# EAGLE design ambient_rpi_shield (EAGLE 7.7.0)
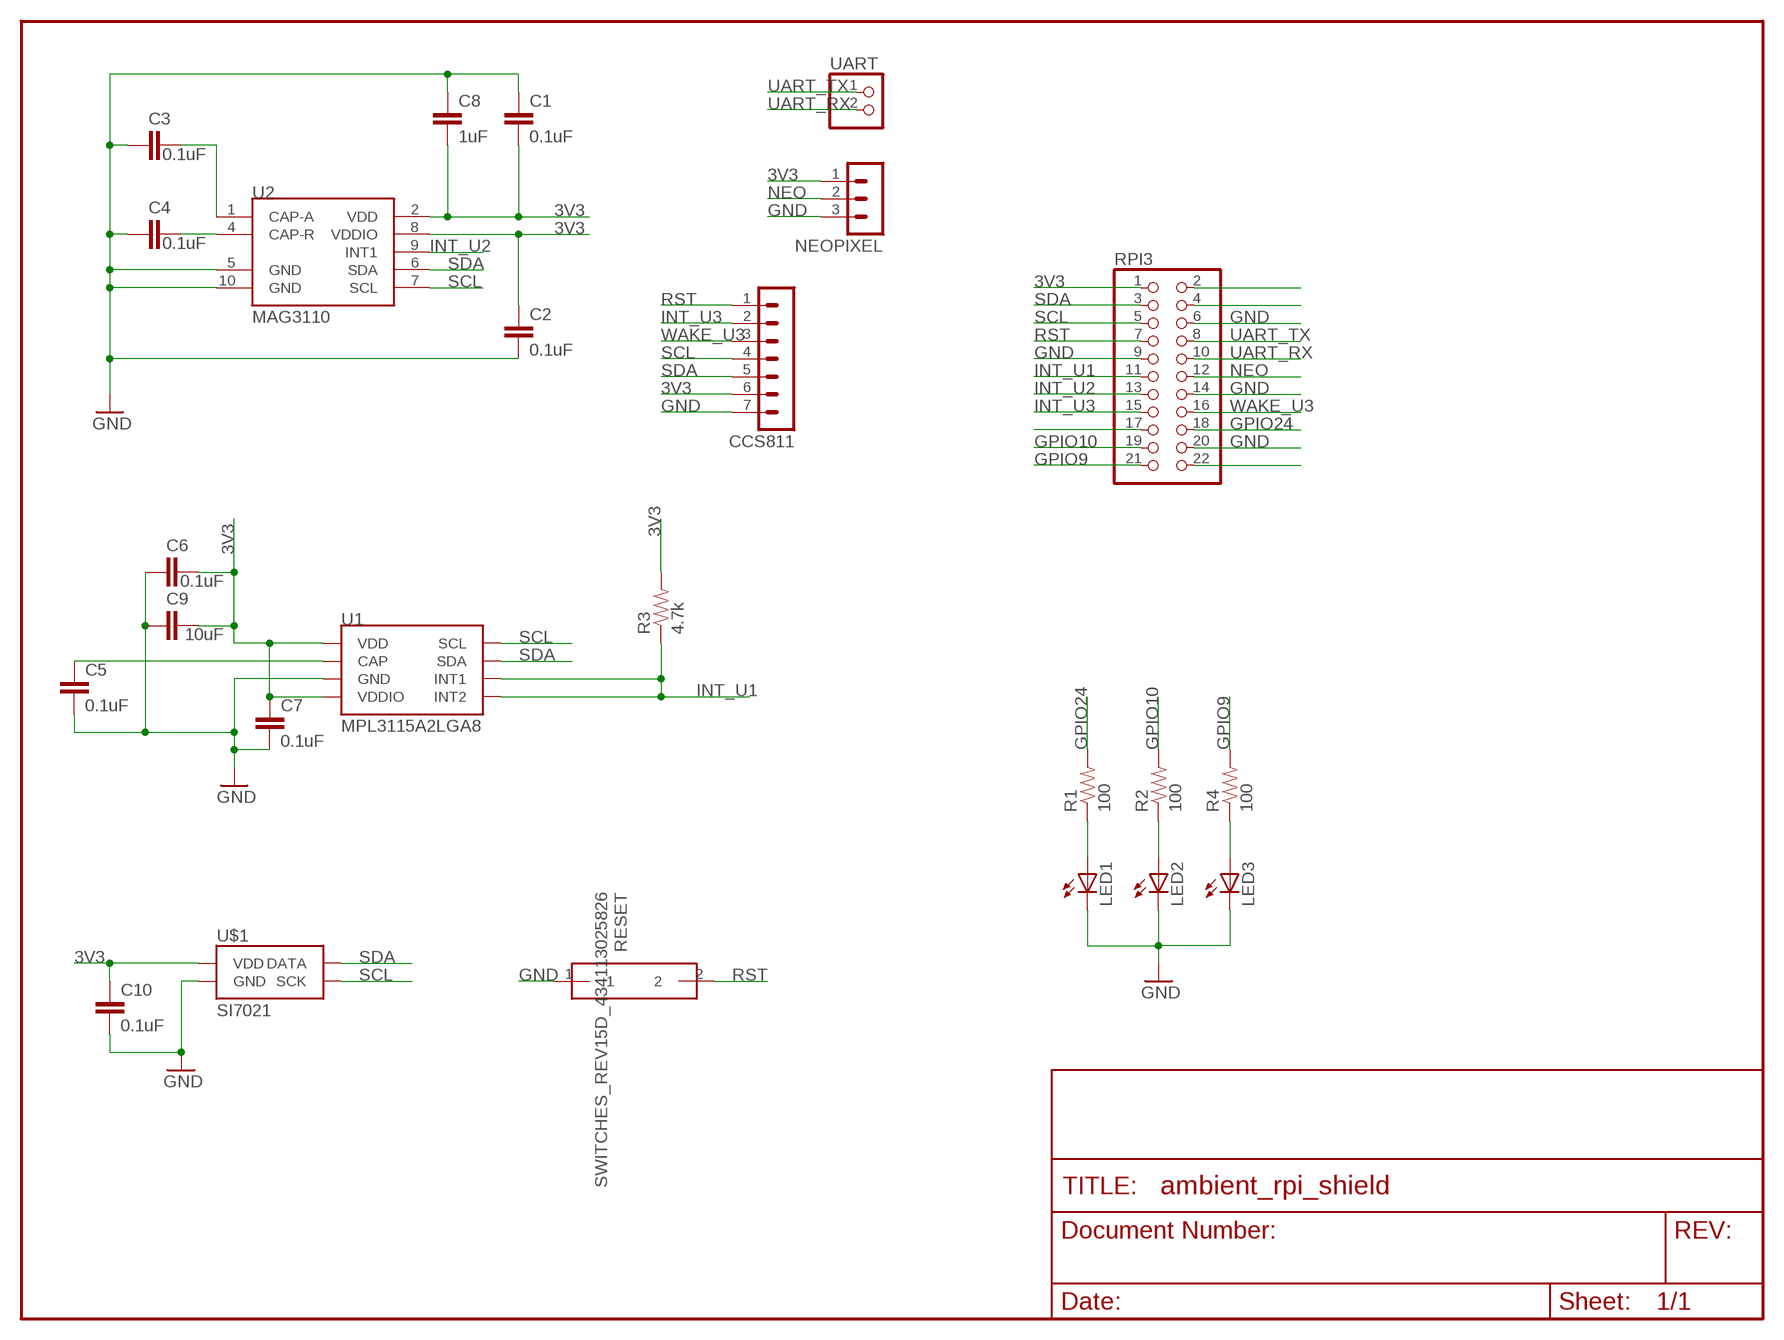
[diagram p0: schematic, sheet 1]

## Parts
C1  0.1uF  CAP0603-CAP  [0603-CAP]
C2  0.1uF  CAP0603-CAP  [0603-CAP]
C3  0.1uF  CAP0603-CAP  [0603-CAP]
C4  0.1uF  CAP0603-CAP  [0603-CAP]
C5  0.1uF  CAP0603-CAP  [0603-CAP]
C6  0.1uF  CAP0603-CAP  [0603-CAP]
C7  0.1uF  CAP0603-CAP  [0603-CAP]
C8  1uF  CAP0603-CAP  [0603-CAP]
C9  10uF  CAP0603-CAP  [0603-CAP]
C10  0.1uF  CAP0603-CAP  [0603-CAP]
CCS811  MA07-1  [MA07-1]
LED1  LED_LEDCHIP-LED0805  [LED_CHIP-LED0805]
LED2  LED_LEDCHIP-LED0805  [LED_CHIP-LED0805]
LED3  LED_LEDCHIP-LED0603  [LED_CHIP-LED0603]
NEOPIXEL  MA03-1  [MA03-1]
R1  100  SPARKFUN_RESISTOR0603-RES  [SPARKFUN_0603-RES]
R2  100  SPARKFUN_RESISTOR0603-RES  [SPARKFUN_0603-RES]
R3  4.7k  RESISTOR0603-RES  [0603-RES]
R4  100  SPARKFUN_RESISTOR0603-RES  [SPARKFUN_0603-RES]
RESET  SWITCHES_REV15D_434113025826  [SWITCHES_REV15D_434113025826]
RPI3  PINHD-2X11  [2X11]
U1  MPL3115A2LGA8  [LGA8]
U2  MAG3110  [DFN-10]
U$1  SI7021  [SI7021]
UART  PINHD-1X2  [1X02]

## Nets
3V3: C1.2 C2.1 C6.2 C7.1 C8.2 C9.2 C10.1 CCS811.6 NEOPIXEL.1 R3.2 RPI3.1 U1.1(VDD) U1.4(VDDIO) U2.2(VDD) U2.8(VDDIO) U$1.VDD
GND: C1.1 C2.2 C3.1 C4.1 C5.2 C6.1 C7.2 C8.1 C9.1 C10.2 CCS811.7 LED1.C LED2.C LED3.C NEOPIXEL.3 RESET.1 RPI3.6 RPI3.9 RPI3.14 RPI3.20 U1.3(GND) U2.5(GND) U2.10(GND) U$1.GND
GPIO9: R4.2 RPI3.21
GPIO10: R2.2 RPI3.19
GPIO24: R1.2 RPI3.18
INT_U1: R3.1 RPI3.11 U1.5(INT2) U1.6(INT1)
INT_U2: RPI3.13 U2.9(INT1)
INT_U3: CCS811.2 RPI3.15
N$1: C3.2 U2.1(CAP-A)
N$2: C4.2 U2.4(CAP-R)
N$3: C5.1 U1.2(CAP)
N$4: LED1.A R1.1
N$5: LED2.A R2.1
N$6: LED3.A R4.1
N$15: RPI3.17
N$18: RPI3.2
N$19: RPI3.4
N$28: RPI3.22
NEO: NEOPIXEL.2 RPI3.12
RST: CCS811.1 RESET.2 RPI3.7
SCL: CCS811.4 RPI3.5 U1.8(SCL) U2.7(SCL) U$1.SCK
SDA: CCS811.5 RPI3.3 U1.7(SDA) U2.6(SDA) U$1.DATA
UART_RX: RPI3.10 UART.2
UART_TX: RPI3.8 UART.1
WAKE_U3: CCS811.3 RPI3.16

## Library data of the parts
C1-C10 = SparkFun-Capacitors:CAP: Capacitor Standard 0603 ceramic capacitor, and 0.1" leaded capacitor.
CCS811 = con-lstb:MA07-1: PIN HEADER; OC_FARNELL: unknown; OC_NEWARK: unknown
LED1-LED3 = OCTA-EZR_v1:LED_LED: LED OSRAM: - CHIPLED LG R971, LG N971, LY N971, LG Q971, LY Q971, LO R971, LY R971 LH N974, LH R974 LS Q976, LO Q976, LY Q976 LO Q996 - Hyper CHIPLED LW Q18S LB Q993, LB Q99A, LB R99A - SideLED LS A670, LO A670, LY A670, LG A670, LP A670 LB A673, LV A673, LT A673, LW A673 LH A674 LY A675 LS A676, LA A676, LO A676, LY A676, LW A676 LS A679, LY A679, LG A679 - Hyper Micro SIDELED® LS Y876, LA Y876, LO Y876, LY Y876 LT Y87S - SmartLED LW L88C, LW L88S LB L89C, LB L89S, LG L890 LS L89K, LO L89K, LY L89K LS L896, LA L896, LO L896, LY L896 - TOPLED LS T670, LO T670, LY T670, LG T670, LP T670 LSG T670, LSP T670, LSY T670, LOP T670, LYG T670 LG T671, LOG T671, LSG T671 LB T673, LV T673, LT T673, LW T673 LH T674 LS T676, LA T676, LO T676, LY T676, LB T676, LH T676, LSB T676, LW T676 LB T67C, LV T67C, LT T67C, LS T67K, LO T67K, LY T67K, LW E67C LS E67B, LA E67B, LO E67B, LY E67B, LB E67C, LV E67C, LT E67C LW T67C LS T679, LY T679, LG T679 LS T770, LO T770, LY T770, LG T770, LP T770 LB T773, LV T773, LT T773, LW T773 LH T774 LS E675, LA E675, LY E675, LS T675 LS T776, LA T776, LO T776, LY T776, LB T776 LHGB T686 LT T68C, LB T68C - Hyper Mini TOPLED® LB M676 - Mini TOPLED Santana® LG M470 LS M47K, LO M47K, LY M47K Source: http://www.osram.convergy.de LUXEON: - LUMILED® LXK2-PW12-R00, LXK2-PW12-S00, LXK2-PW14-U00, LXK2-PW14-V00 LXK2-PM12-R00, LXK2-PM12-S00, LXK2-PM14-U00 LXK2-PE12-Q00, LXK2-PE12-R00, LXK2-PE12-S00, LXK2-PE14-T00, LXK2-PE14-U00 LXK2-PB12-K00, LXK2-PB12-L00, LXK2-PB12-M00, LXK2-PB14-N00, LXK2-PB14-P00, LXK2-PB14-Q00 LXK2-PR12-L00, LXK2-PR12-M00, LXK2-PR14-Q00, LXK2-PR14-R00 LXK2-PD12-Q00, LXK2-PD12-R00, LXK2-PD12-S00 LXK2-PH12-R00, LXK2-PH12-S00 LXK2-PL12-P00, LXK2-PL12-Q00, LXK2-PL12-R00 Source: www.luxeon.com KINGBRIGHT: KA-3528ASYC Source: www.kingbright.com
NEOPIXEL = con-lstb:MA03-1: PIN HEADER; OC_FARNELL: unknown; OC_NEWARK: unknown
R1 R2 R4 = OCTA-EZR_v1:SPARKFUN_RESISTOR: Resistor Basic schematic elements and footprints for 0603, 1206, and PTH resistors.
R3 = SparkFun-Resistors:RESISTOR: Resistor Basic schematic elements and footprints for 0603, 1206, and PTH resistors.
RESET = OCTA-EZR_v1:SWITCHES_REV15D_434113025826: WS-TRS-6x3.8 mm J-Bend SMD Tact Switch, 2 pins
RPI3 = pinhead:PINHD-2X11: PIN HEADER
U1 = SparkFun-Sensors:MPL3115A2: Altimeter/Pressure Sensor, I2C, 1.95V-3.6V supply, 50 to 110kPa; PROD_ID: IC-10869
U2 = SparkFun-Sensors:MAG3110: 3-axis digital (I2C) magnetometer
U$1 = SparkFun-Sensors:SI7021: The Si7021 is an I2C Humidity and Temperature Sensor; PROD_ID: IC-13093
UART = pinhead:PINHD-1X2: PIN HEADER

## Board
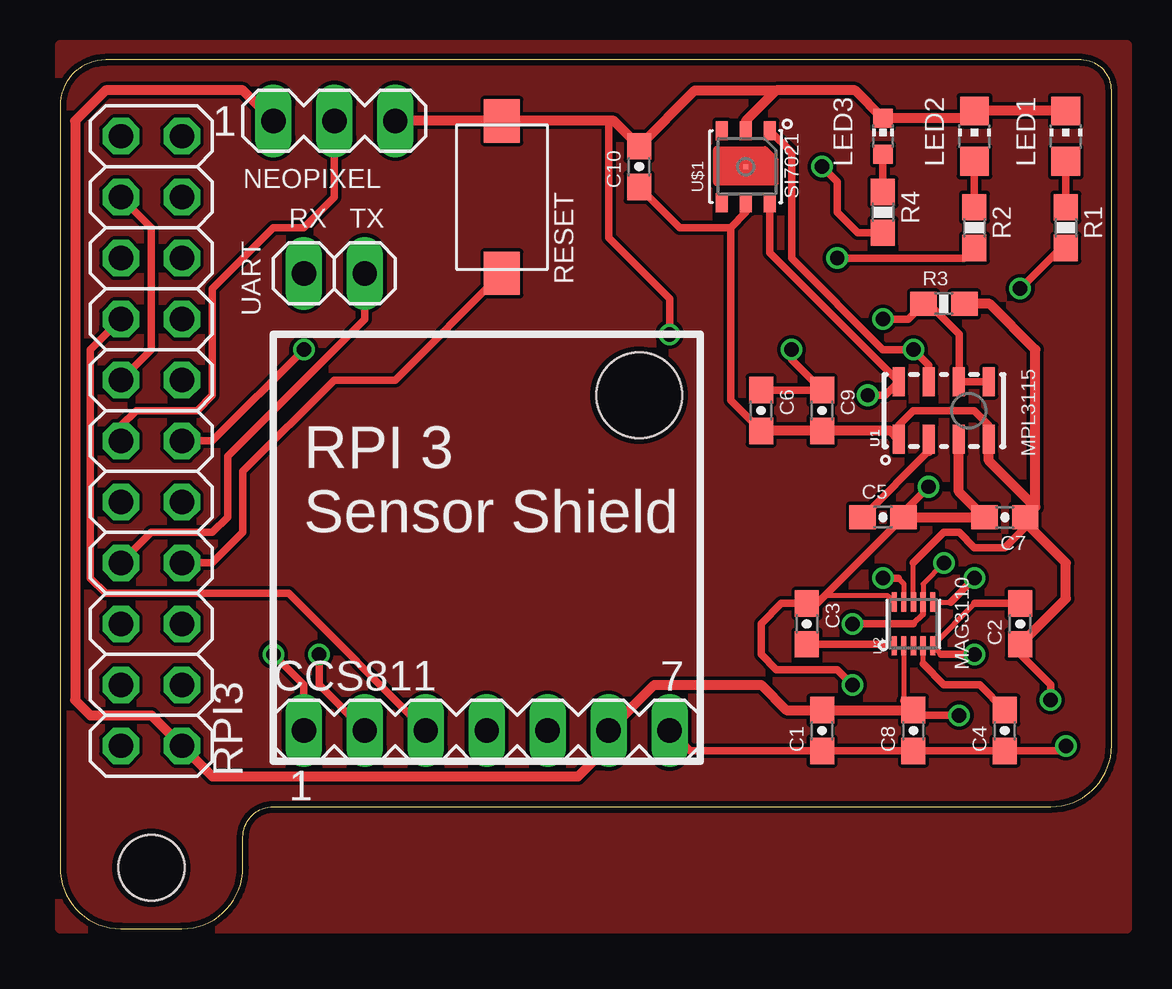
[diagram p1: board, top side]
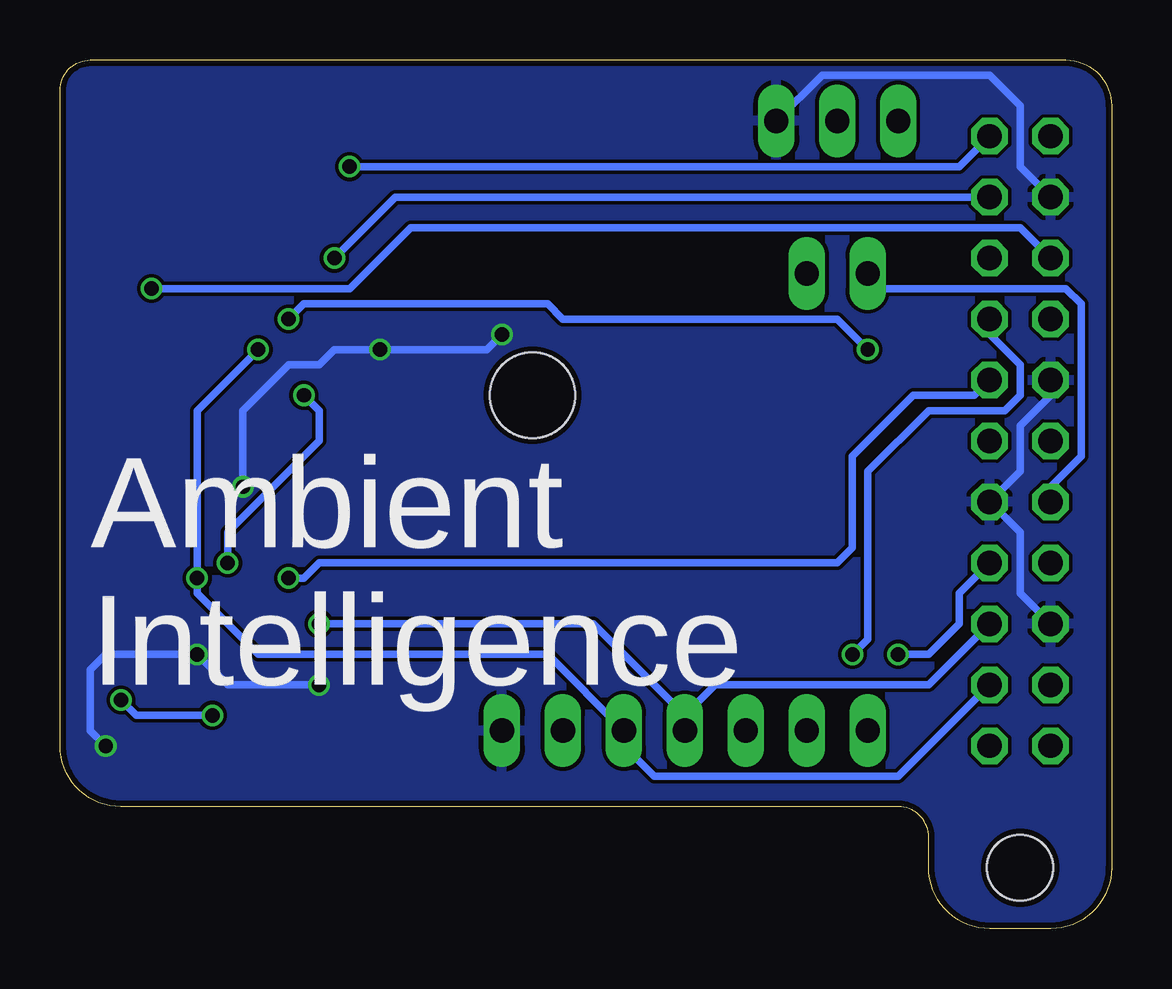
[diagram p2: board, bottom side, seen from below]

Size 43.81 x 36.2 mm. Coordinates in mm from the lower left corner, seen from the top.
Outline: 0,2.54 arc90 2.54,0 5.08,0 arc90 7.62,2.54 7.62,3.81 arc-90 8.89,5.08 41.27,5.08 arc90 43.81,7.62 43.81,34.92 arc90 42.55,36.2 1.91,36.2 arc90 0,34.29 0,2.54
Copper layers (1*16): Top 0.018mm / dielectric 1.55mm / Bottom 0.018mm
Design rules "eC_2Layer_PClass6_BaseCopperO18_eCDefault": minimum track width 0.15mm, minimum drill 0.35mm, track to track 0.15mm, track to pad 0.15mm, pad to pad 0.15mm, via to via 0.15mm, smd to smd 0mil, copper to edge 0.25mm, drill to drill 0.35mm, minimum pad ring 0.175mm, minimum via ring 0.125mm, stop-mask expansion 0mil, vias tented up to drill 0.45mm, thermal gap 0.2mm
Holes 3.56 mm at 24.13,22.23
Holes 2.75 mm at 3.81,2.54

### Footprints (pad centres in the part's own frame; a part is rotated, then mirrored left to right if it is on the bottom)
0603-CAP = smd 1.1 x 1: 1 -0.85,0; 2 0.85,0
MA07-1 = drill 1.016 long: 1 -7.62,0; 2 -5.08,0; 3 -2.54,0; 4 0,0; 5 2.54,0; 6 5.08,0; 7 7.62,0
LED_CHIP-LED0805 = smd 1.2 x 1.2: A 0,-1.05; C 0,1.05
LED_CHIP-LED0603 = smd 0.8 x 0.8: A 0,-0.75; C 0,0.75
MA03-1 = drill 1.016 long: 1 -2.54,0; 2 0,0; 3 2.54,0
SPARKFUN_0603-RES = smd 1.1 x 1: 1 -0.85,0; 2 0.85,0
0603-RES = smd 1.1 x 1: 1 -0.85,0; 2 0.85,0
SWITCHES_REV15D_434113025826 = smd 1.8 x 1.5: 1 -3.175,0; 2 3.175,0
2X11 = drill 1.016 octagon: 1 -12.7,-1.27; 2 -12.7,1.27; 3 -10.16,-1.27; 4 -10.16,1.27; 5 -7.62,-1.27; 6 -7.62,1.27; 7 -5.08,-1.27; 8 -5.08,1.27; 9 -2.54,-1.27; 10 -2.54,1.27; 11 0,-1.27; 12 0,1.27; 13 2.54,-1.27; 14 2.54,1.27; 15 5.08,-1.27; 16 5.08,1.27; 17 7.62,-1.27; 18 7.62,1.27; 19 10.16,-1.27; 20 10.16,1.27; 21 12.7,-1.27; 22 12.7,1.27
LGA8 = smd 1.2 x 0.5: 1 -1.2,1.875; 2 -1.2,0.625; 3 -1.2,-0.625; 4 -1.2,-1.875; 5 1.2,-1.875; 6 1.2,-0.625; 7 1.2,0.625; 8 1.2,1.875
DFN-10 = smd 0.8 x 0.22: 1 -0.91,0.8; 2 -0.91,0.4; 3 -0.91,0; 4 -0.91,-0.4; 5 -0.91,-0.8; 6 0.91,-0.8; 7 0.91,-0.4; 8 0.91,0; 9 0.91,0.4; 10 0.91,0.8
SI7021 = smd 0.2 x 0.2: 7 0,0 | smd 0.8 x 0.5: DATA 1.5,-1; GND 1.5,0; NC@3 1.5,1; NC@4 -1.5,1; SCK -1.5,-1; VDD -1.5,0
1X02 = drill 1.016 long: 1 -1.27,0; 2 1.27,0

### Placement (x,y rotation side)
C1  31.75,8.25 90 top
C2  40.01,12.7 90 top
C3  31.11,12.7 270 top
C4  39.37,8.25 90 top
C5  34.29,17.14 0 top
C6  29.21,21.59 270 top
C7  39.37,17.14 180 top
C8  35.56,8.25 90 top
C9  31.75,21.59 270 top
C10  24.13,31.75 90 top
CCS811  17.78,8.25 0 top
LED1  41.91,33.02 0 top
LED2  38.1,33.02 0 top
LED3  34.29,33.02 0 top
NEOPIXEL  11.43,33.66 0 top
R1  41.91,29.21 270 top
R2  38.1,29.21 270 top
R3  36.83,26.03 0 top
R4  34.29,29.84 270 top
RESET  18.41,30.48 270 top
RPI3  3.81,20.32 90 top
U1  36.83,21.59 90 top
U2  35.56,12.7 90 top
U$1  28.57,31.75 90 top
UART  11.43,27.3 180 top

### Tracks (layer width: path | path; a pad name or v marks a point on that pad's centre or on a via)
3V3  (via drill 0.6)
  Top 0.203: U2.8 35.56,15.24 | U2.2 35.16,9.5
  Top 0.305: 35.16,9.5 C8.2 35.77,8.89 v37.47,8.89 | U1.4 38.7,20.98 38.1,21.59 35.56,21.59 34.95,20.98 U1.1 | C10.1 25.82,29.21 27.94,29.21 | 27.94,29.21 28.57,29.84 U$1.VDD | C7.1 40.22,16.73 39.37,15.88 38.1,15.88 37.47,16.51 36.83,16.51 35.56,15.24 | C6.2 27.94,22.01 27.94,29.21 | v41.27,9.53 41.27,10.16 40.01,11.43 C2.1
  Top 0.406: C8.2 C1.2 30.27,9.11 29.21,10.16 24.77,10.16 CCS811.6 22.86,7.62 21.59,6.35 6.35,6.35 RPI3.1 3.81,8.89 1.27,8.89 0.64,9.53 0.64,33.66 1.91,34.92 7.62,34.92 NEOPIXEL.1 | C2.1 41.91,13.76 41.91,15.24 40.22,16.93 C7.1 40.64,17.56 | 40.64,17.56 40.64,24.13 38.73,26.03 R3.2 | 40.64,17.56 38.7,19.5 U1.4 | U1.1 34.6,20.74 C9.2 C6.2
  Bottom 0.305: v37.47,8.89 40.64,8.89 v41.27,9.53
GND  (via drill 0.6)
  Top 0.203: U2.10 34.51,13.86 31.86,13.86 | 38.12,13.55 U2.5 36.72,11.43
  Top 0.305: C6.1 C9.1 30.48,23.71 v30.48,24.13 | 38.12,13.55 C2.2 | CCS811.7 26.25,7.41 C1.1 C8.1 C4.1 41.7,7.41 v41.91,7.62 | 22.86,33.66 22.86,28.79 25.4,26.25 v25.4,24.77 | RPI3.14 3.81,24.13 3.81,29.21 RPI3.20 | 36.72,11.43 v38.1,11.43 | v36.2,18.41 35.14,17.36 C5.2 31.86,13.86 31.55,13.55 C3.1 30.06,13.55 29.21,12.7 29.21,11.43 29.84,10.79 32.38,10.79 v33.02,10.16
  Top 0.406: U1.3 37.45,18.21 C7.2 C5.2 | LED1.C LED2.C 37.8,33.77 LED3.C 33.13,34.92 29.84,34.92 | 29.84,34.92 28.57,33.66 U$1.GND | 29.84,34.92 26.45,34.92 C10.2 23.07,33.66 22.86,33.66 RESET.1 NEOPIXEL.3
  Bottom 0.305: RPI3.20 3.81,31.75 3.81,34.29 5.08,35.56 12.06,35.56 NEOPIXEL.3 | RPI3.6 3.81,13.97 3.81,16.51 RPI3.9 3.81,19.05 3.81,20.95 2.54,22.23 RPI3.14 | v41.91,7.62 42.55,8.25 42.55,10.79 41.91,11.43 v38.1,11.43 36.83,10.16 v33.02,10.16 | v36.2,18.41 36.2,21.59 34.29,23.49 33.02,23.49 32.38,24.13 v30.48,24.13 26.04,24.13 v25.4,24.77
  pour Bottom: 0,36.83 44.45,36.83 44.45,0 0,0
GPIO9  (via drill 0.6)
  Top 0.305: v31.75,31.75 32.38,31.12 32.38,29.84 33.23,28.99 R4.2
  Bottom 0.305: RPI3.21 6.35,31.75 v31.75,31.75
GPIO10  (via drill 0.6)
  Top 0.305: R2.2 37.68,27.94 v32.38,27.94
  Bottom 0.305: v32.38,27.94 29.84,30.48 RPI3.19
GPIO24  (via drill 0.6)
  Top 0.305: v40.01,26.67 41.7,28.36 R1.2
  Bottom 0.305: RPI3.18 3.81,29.21 29.21,29.21 31.75,26.67 v40.01,26.67
INT_U1  (via drill 0.6)
  Top 0.305: U1.5 U1.6 37.47,22.8 37.47,24.77 36.2,26.03 R3.1 35.34,25.4 v34.29,25.4 | v10.16,24.13 6.35,20.32 RPI3.11
  Bottom 0.305: v10.16,24.13 11.43,25.4 22.86,25.4 23.5,26.03 33.66,26.03 v34.29,25.4
INT_U2  (via drill 0.6)
  Top 0.203: 34.92,14.61 35.16,14.37 U2.9
  Top 0.305: v34.29,14.61 34.92,14.61
  Bottom 0.305: RPI3.13 5.71,22.23 8.26,22.23 10.79,19.69 10.79,15.88 11.43,15.24 33.02,15.24 33.66,14.61 v34.29,14.61
INT_U3  (via drill 0.6)
  Top 0.305: CCS811.2 10.79,10.16 v10.79,11.43
  Bottom 0.305: v10.79,11.43 10.16,12.07 10.16,19.05 7.62,21.59 4.45,21.59 3.81,22.23 3.81,23.49 5.08,24.77 RPI3.15
N$1
  Top 0.203: U2.1 34.7,11.85
  Top 0.305: 34.7,11.85 34.29,11.85 C3.2
N$2
  Top 0.203: 35.96,11.03 U2.4
  Top 0.305: C4.2 38.31,10.16 36.83,10.16 35.96,11.03
N$3
  Top 0.305: C5.1 36.2,19.91
  Top 0.406: 36.2,19.91 U1.2
N$4
  Top 0.305: LED1.A R1.1
N$5
  Top 0.305: LED2.A R2.1
N$6
  Top 0.305: LED3.A R4.1
N$7
  pour Top: 0,36.83 44.45,36.83 44.45,0 0,0
NEO
  Top 0.305: NEOPIXEL.2 11.43,30.48 10.16,29.21 8.89,29.21 6.35,26.67 6.35,22.23 5.71,21.59 3.17,21.59 2.54,20.95 RPI3.12
RST  (via drill 0.6)
  Top 0.305: v8.89,11.43 10.16,10.16 CCS811.1 | RESET.2 13.97,22.86 11.43,22.86 7.62,19.05 7.62,16.51 6.35,15.24 RPI3.7
  Bottom 0.305: RPI3.7 6.35,13.97 6.35,12.7 7.62,11.43 v8.89,11.43
SCL  (via drill 0.6)
  Top 0.203: v36.83,15.24 35.96,14.37 U2.7
  Top 0.254: 35.56,12.7 35.96,13.1 U2.7
  Top 0.305: v33.02,12.7 35.56,12.7 | U$1.SCK 29.57,28.17 U1.8 34.39,22.23 v33.66,22.23
  Bottom 0.305: RPI3.5 7.62,10.16 16.51,10.16 17.78,8.89 | 17.78,8.89 CCS811.4 | 17.78,8.89 21.59,12.7 v33.02,12.7 | v33.66,22.23 33.02,21.59 33.02,20.32 36.83,16.51 v36.83,15.24
SDA  (via drill 0.6)
  Top 0.203: U2.6 37.1,13.61
  Top 0.305: U$1.DATA 30.48,32.34 30.48,27.94 34.29,24.13 v35.56,24.13 36.2,23.48 U1.7 | v38.1,14.61 37.1,13.61
  Bottom 0.305: RPI3.3 8.89,6.35 19.05,6.35 20.32,7.62 CCS811.5 23.5,11.43 35.56,11.43 38.1,13.97 v38.1,14.61 38.1,21.59 v35.56,24.13
UART_RX
  Bottom 0.305: UART.2 9.53,26.67 1.91,26.67 1.27,26.03 1.27,19.69 2.54,18.41 RPI3.10
UART_TX
  Top 0.305: RPI3.8 3.81,16.51 6.35,16.51 6.99,17.14 6.99,19.69 12.7,25.4 UART.1
WAKE_U3
  Top 0.305: CCS811.3 9.53,13.97 1.91,13.97 1.27,14.61 1.27,24.13 RPI3.16

### Text on the board
tPlace: RX | TX | MPL3115 | RPI 3 / Sensor Shield
bPlace: Ambient / Intelligence